# Altium schematic sheet ADC+Temp.SchDoc
size A3; SheetNumber: 5; SheetTotal: 10
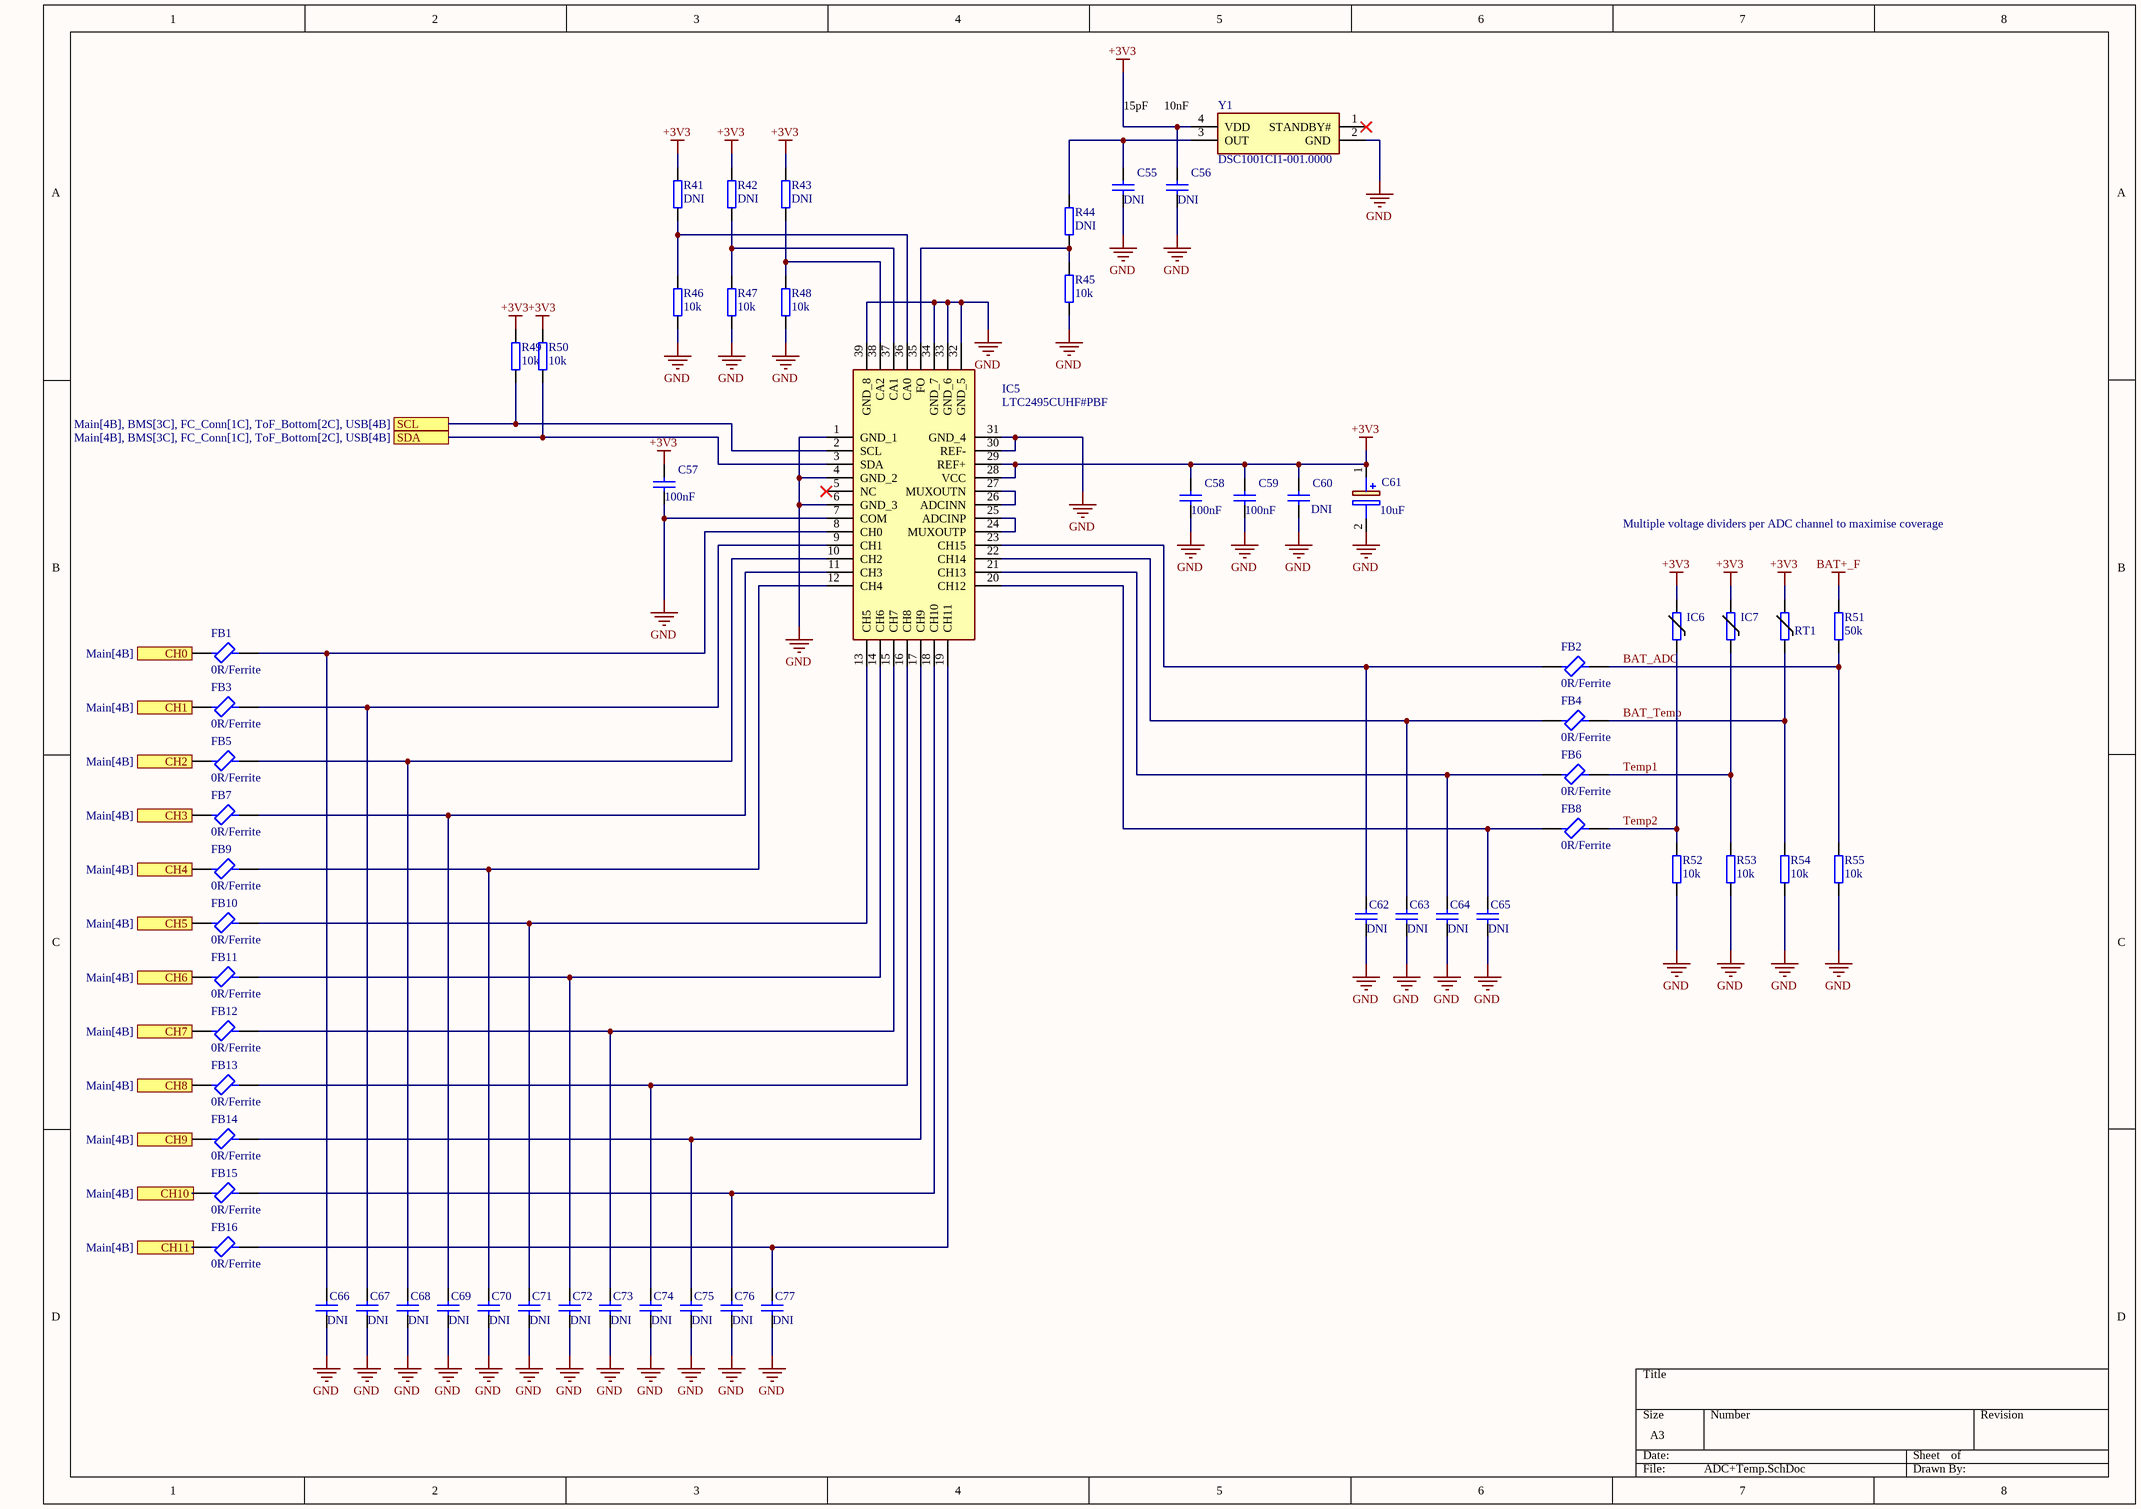
[diagram p0: ADC+Temp.SchDoc]

## Parts
C55  value DNI  [CAP0402]  (hidden comment: Cap0402)
C56  value DNI  [CAP0402]  (hidden comment: Cap0402)
C57  value 100nF  [CAP0402]  (hidden comment: Cap0402)
C58  value 100nF  [CAP0402]  (hidden comment: Cap0402)
C59  value 100nF  [CAP0402]  (hidden comment: Cap0402)
C60  value DNI  [CAP0603]  (hidden comment: Cap0603)
C61  value 10uF  [CAPPC1608X90N]  (hidden comment: TMCJ0J106MTRF)
C62  value DNI  [CAP0402]  (hidden comment: Cap0402)
C63  value DNI  [CAP0402]  (hidden comment: Cap0402)
C64  value DNI  [CAP0402]  (hidden comment: Cap0402)
C65  value DNI  [CAP0402]  (hidden comment: Cap0402)
C66  value DNI  [CAP0402]  (hidden comment: Cap0402)
C67  value DNI  [CAP0402]  (hidden comment: Cap0402)
C68  value DNI  [CAP0402]  (hidden comment: Cap0402)
C69  value DNI  [CAP0402]  (hidden comment: Cap0402)
C70  value DNI  [CAP0402]  (hidden comment: Cap0402)
C71  value DNI  [CAP0402]  (hidden comment: Cap0402)
C72  value DNI  [CAP0402]  (hidden comment: Cap0402)
C73  value DNI  [CAP0402]  (hidden comment: Cap0402)
C74  value DNI  [CAP0402]  (hidden comment: Cap0402)
C75  value DNI  [CAP0402]  (hidden comment: Cap0402)
C76  value DNI  [CAP0402]  (hidden comment: Cap0402)
C77  value DNI  [CAP0402]  (hidden comment: Cap0402)
FB1  0R/Ferrite  [NFZ15SG152SN10B]
FB2  0R/Ferrite  [NFZ15SG152SN10B]
FB3  0R/Ferrite  [NFZ15SG152SN10B]
FB4  0R/Ferrite  [NFZ15SG152SN10B]
FB5  0R/Ferrite  [NFZ15SG152SN10B]
FB6  0R/Ferrite  [NFZ15SG152SN10B]
FB7  0R/Ferrite  [NFZ15SG152SN10B]
FB8  0R/Ferrite  [NFZ15SG152SN10B]
FB9  0R/Ferrite  [NFZ15SG152SN10B]
FB10  0R/Ferrite  [NFZ15SG152SN10B]
FB11  0R/Ferrite  [NFZ15SG152SN10B]
FB12  0R/Ferrite  [NFZ15SG152SN10B]
FB13  0R/Ferrite  [NFZ15SG152SN10B]
FB14  0R/Ferrite  [NFZ15SG152SN10B]
FB15  0R/Ferrite  [NFZ15SG152SN10B]
FB16  0R/Ferrite  [NFZ15SG152SN10B]
IC5  LTC2495CUHF#PBF  [QFN50P500X700X80-39N-D]
IC6  TMP6131DECR  [TMP6131DECR]  (value not drawn)
IC7  TMP6131DECR  [TMP6131DECR]  (value not drawn)
R41  value DNI  [RES0402]  (hidden comment: Res0402)
R42  value DNI  [RES0402]  (hidden comment: Res0402)
R43  value DNI  [RES0402]  (hidden comment: Res0402)
R44  value DNI  [RES0402]  (hidden comment: Res0402)
R45  value 10k  [RES0402]  (hidden comment: Res0402)
R46  value 10k  [RES0402]  (hidden comment: Res0402)
R47  value 10k  [RES0402]  (hidden comment: Res0402)
R48  value 10k  [RES0402]  (hidden comment: Res0402)
R49  value 10k  [RES0402]  (hidden comment: Res0402)
R50  value 10k  [RES0402]  (hidden comment: Res0402)
R51  value 50k  [RES0402]  (hidden comment: Res0402)
R52  value 10k  [RES0402]  (hidden comment: Res0402)
R53  value 10k  [RES0402]  (hidden comment: Res0402)
R54  value 10k  [RES0402]  (hidden comment: Res0402)
R55  value 10k  [RES0402]  (hidden comment: Res0402)
RT1  B57862L0103F000/B59100M1080A070  [B57862L0102F000]  (value not drawn)
Y1  DSC1001CI1-001.0000  [DSC1001CI10010000]

## Ports
CH0 (see Main[4B]), CH1 (see Main[4B]), CH2 (see Main[4B]), CH3 (see Main[4B]), CH4 (see Main[4B]), CH5 (see Main[4B]), CH6 (see Main[4B]), CH7 (see Main[4B]), CH8 (see Main[4B]), CH9 (see Main[4B]), CH10 (see Main[4B]), CH11 (see Main[4B]), SCL (see Main[4B], BMS[3C], FC_Conn[1C], ToF_Bottom[2C], USB[4B]), SDA (see Main[4B], BMS[3C], FC_Conn[1C], ToF_Bottom[2C], USB[4B])

## Nets
+3V3: C56.2 C57.2 C58.2 C59.2 C60.2 C61.1(+) IC5.28(VCC) IC5.29(REF+) IC6.2 IC7.2 R41.2 R42.2 R43.2 R49.2 R50.2 RT1.2 Y1.4(VDD)
BAT+_F: R51.2
GND: C55.1 C56.1 C57.1 C58.1 C59.1 C60.1 C61.2(-) C62.1 C63.1 C64.1 C65.1 C66.1 C67.1 C68.1 C69.1 C70.1 C71.1 C72.1 C73.1 C74.1 C75.1 C76.1 C77.1 IC5.1(GND_1) IC5.4(GND_2) IC5.6(GND_3) IC5.7(COM) IC5.30(REF-) IC5.31(GND_4) IC5.32(GND_5) IC5.33(GND_6) IC5.34(GND_7) IC5.39(GND_8) R45.1 R46.1 R47.1 R48.1 R52.1 R53.1 R54.1 R55.1 Y1.2(GND)
BAT_ADC: FB2.2 R51.1 R55.2
BAT_Temp: FB4.2 R54.2 RT1.1
CH0: FB1.1 ; port CH0
CH1: FB3.1 ; port CH1
CH2: FB5.1 ; port CH2
CH3: FB7.1 ; port CH3
CH4: FB9.1 ; port CH4
CH5: FB10.1 ; port CH5
CH6: FB11.1 ; port CH6
CH7: FB12.1 ; port CH7
CH8: FB13.1 ; port CH8
CH9: FB14.1 ; port CH9
CH10: FB15.1 ; port CH10
CH11: FB16.1 ; port CH11
SCL: IC5.2(SCL) R49.1 ; port SCL
SDA: IC5.3(SDA) R50.1 ; port SDA
Temp1: FB6.2 IC7.1 R53.2
Temp2: FB8.2 IC6.1 R52.2
NetC55_2: C55.2 R44.2 Y1.3(OUT)
NetC62_2: C62.2 FB2.1 IC5.23(CH15)
NetC63_2: C63.2 FB4.1 IC5.22(CH14)
NetC64_2: C64.2 FB6.1 IC5.21(CH13)
NetC65_2: C65.2 FB8.1 IC5.20(CH12)
NetC66_2: C66.2 FB1.2 IC5.8(CH0)
NetC67_2: C67.2 FB3.2 IC5.9(CH1)
NetC68_2: C68.2 FB5.2 IC5.10(CH2)
NetC69_2: C69.2 FB7.2 IC5.11(CH3)
NetC70_2: C70.2 FB9.2 IC5.12(CH4)
NetC71_2: C71.2 FB10.2 IC5.13(CH5)
NetC72_2: C72.2 FB11.2 IC5.14(CH6)
NetC73_2: C73.2 FB12.2 IC5.15(CH7)
NetC74_2: C74.2 FB13.2 IC5.16(CH8)
NetC75_2: C75.2 FB14.2 IC5.17(CH9)
NetC76_2: C76.2 FB15.2 IC5.18(CH10)
NetC77_2: C77.2 FB16.2 IC5.19(CH11)
NetIC5_24: IC5.24(MUXOUTP) IC5.25(ADCINP)
NetIC5_26: IC5.26(ADCINN) IC5.27(MUXOUTN)
NetIC5_35: IC5.35(FO) R44.1 R45.2
NetIC5_36: IC5.36(CA0) R41.1 R46.2
NetIC5_37: IC5.37(CA1) R42.1 R47.2
NetIC5_38: IC5.38(CA2) R43.1 R48.2

Not connected (* = marked no-connect by the designer): IC5 5(NC)*; Y1 1(STANDBY#)*

## Notes on the sheet
- 15pF
- (near Y1) 10nF
- Multiple voltage dividers per ADC channel to maximise coverage

## Library data of the parts
C55 C56 = Cap0402: DNI; Voltage: DNI
C57-C59 = Cap0402: Voltage: 50V
C61 = 298D106X96R3M2T: Capacitor Polarised; Voltage: 6V3
FB1-FB16 = BLM15PE471SH1D: Ferrite Bead; Manufacturer_Name: Murata Electronics; Datasheet Link: https://www.murata.com/en-global/products/productdetail.aspx?cate=luNoiseSupprFilteChipFerriBead&partno=BLM15PE471SH1%23; Height: 0.55mm; Manufacturer_Part_Number: BLM15PE471SH1D; Mouser Part Number: 81-BLM15PE471SH1D; Mouser Price/Stock: https://www.mouser.co.uk/ProductDetail/Murata-Electronics/BLM15PE471SH1D?qs=DRkmTr78QATAY5qAVx1hGA%3D%3D
IC5 = LTC2495CUHF#PBF: Integrated Circuit; Manufacturer_Name: Analog Devices; Datasheet Link: https://www.analog.com/media/en/technical-documentation/data-sheets/2495fe.pdf; Height: 0.8mm; Manufacturer_Part_Number: LTC2495CUHF#PBF; Mouser Part Number: 584-LTC2495CUHF#PBF; Mouser Price/Stock: https://www.mouser.co.uk/ProductDetail/Analog-Devices/LTC2495CUHFPBF?qs=hVkxg5c3xu%252Bd9nHQ1gaMcw%3D%3D; Arrow Part Number: LTC2495CUHF#PBF; Arrow Price/Stock: https://www.arrow.com/en/products/ltc2495cuhfpbf/analog-devices?region=europe
IC6 IC7 = TMP6131DECR: Integrated Circuit; Manufacturer_Name: Texas Instruments; Datasheet Link: http://www.ti.com/lit/gpn/TMP61; Height: 0.5mm; Manufacturer_Part_Number: TMP6131DECR; Mouser Part Number: 595-TMP6131DECR; Mouser Price/Stock: https://www.mouser.co.uk/ProductDetail/Texas-Instruments/TMP6131DECR?qs=l7cgNqFNU1jnXQehRCOLwA%3D%3D; Arrow Part Number: TMP6131DECR; Arrow Price/Stock: https://www.arrow.com/en/products/tmp6131decr/texas-instruments?region=nac
RT1 = B57862L0103F000: Thermistor; Manufacturer_Name: TDK; Datasheet Link: https://product.tdk.com/system/files/dam/doc/product/sensor/ntc/ntc_element/data_sheet/50/db/ntc/ntc_mini_sensors_l862.pdf; Height: 6.5mm; Manufacturer_Part_Number: B57862L0103F000; Mouser Part Number: 871-B57862L0103F000; Mouser Price/Stock: https://www.mouser.co.uk/ProductDetail/EPCOS-TDK/B57862L0103F000?qs=ZcfC38r4PovcwIqh7%252BPHpQ%3D%3D
Y1 = DSC1001CI1-001.0000: DNI; Manufacturer_Name: Microchip; Datasheet Link: https://ww1.microchip.com/downloads/aemDocuments/documents/OTH/ProductDocuments/DataSheets/20005529B.pdf; Height: 0.9mm; Manufacturer_Part_Number: DSC1001CI1-001.0000; Mouser Part Number: 998-1001CI1-001.0000; Mouser Price/Stock: https://www.mouser.co.uk/ProductDetail/Microchip-Technology/DSC1001CI1-001.0000?qs=moDRE%2FDosU0f1JofGoWHJw%3D%3D
C60 = Cap0603: Voltage: DNI
C62-C77 = Cap0402: Voltage: DNI